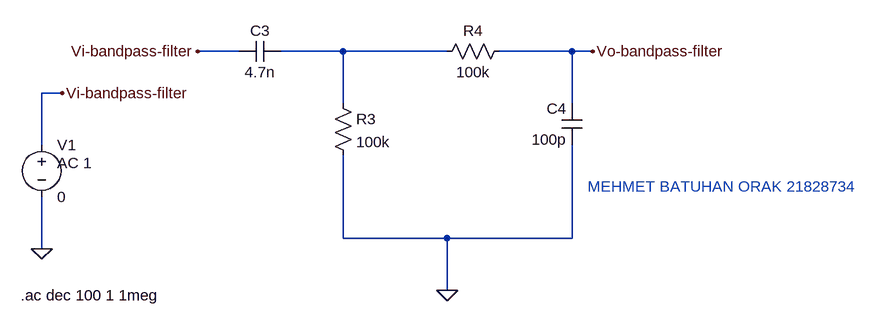
[diagram p0: schematic 2-bandpassfilter.asc]
2-bandpassfilter.asc, the LTspice schematic file:
Version 4
SHEET 1 3084 680
WIRE -2144 -496 -2208 -496
WIRE -1984 -496 -2080 -496
WIRE -1824 -496 -1984 -496
WIRE -1632 -496 -1744 -496
WIRE -1600 -496 -1632 -496
WIRE -2416 -432 -2448 -432
WIRE -1984 -416 -1984 -496
WIRE -1632 -416 -1632 -496
WIRE -2448 -352 -2448 -432
WIRE -1984 -208 -1984 -336
WIRE -1824 -208 -1984 -208
WIRE -1632 -208 -1632 -352
WIRE -1632 -208 -1824 -208
WIRE -2448 -192 -2448 -272
WIRE -1824 -128 -1824 -208
FLAG -2416 -432 Vi-bandpass-filter
FLAG -2448 -192 0
FLAG -2208 -496 Vi-bandpass-filter
FLAG -1824 -128 0
FLAG -1600 -496 Vo-bandpass-filter
SYMBOL voltage -2448 -368 R0
WINDOW 123 24 44 Left 2
WINDOW 39 0 0 Left 0
SYMATTR Value2 AC 1
SYMATTR InstName V1
SYMATTR Value 0
SYMBOL res -2000 -432 R0
SYMATTR InstName R3
SYMATTR Value 100k
SYMBOL cap -2080 -512 R90
WINDOW 0 0 32 VBottom 2
WINDOW 3 32 32 VTop 2
SYMATTR InstName C3
SYMATTR Value 4.7n
SYMBOL res -1728 -512 R90
WINDOW 0 0 56 VBottom 2
WINDOW 3 32 56 VTop 2
SYMATTR InstName R4
SYMATTR Value 100k
SYMBOL cap -1616 -352 R180
WINDOW 0 24 56 Left 2
WINDOW 3 24 8 Left 2
SYMATTR InstName C4
SYMATTR Value 100p
TEXT -2480 -120 Left 2 !.ac dec 100 1 1meg
TEXT -1608 -288 Left 2 ;MEHMET BATUHAN ORAK 21828734

The netlist it stands for:
* 2-bandpassfilter.asc
V1 Vi-bandpass-filter 0 0 AC 1
R3 N001 0 100k
C3 N001 Vi-bandpass-filter 4.7n
R4 Vo-bandpass-filter N001 100k
C4 0 Vo-bandpass-filter 100p
.ac dec 100 1 1meg
* MEHMET BATUHAN ORAK 21828734
.backanno
.end

* Results of the author's LTspice run, read from the files saved beside the schematic
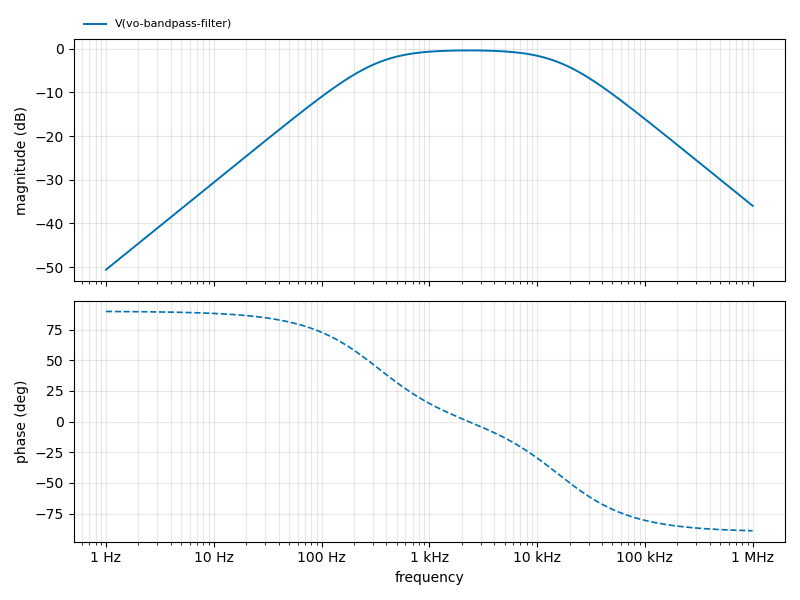
[diagram p1: AC Analysis of 2-bandpassfilter.asc, plotted from the saved traces]
* AC Analysis, 1 run:
*   V(vo-bandpass-filter): -50.59 dB at 1 Hz, -35.96 dB at 1 MHz, peak -0.36 dB at 2.344 kHz, 3 dB below the peak at 318.7 Hz and 16.91 kHz